# Altium schematic sheet Schematics1.SchDoc
size A4
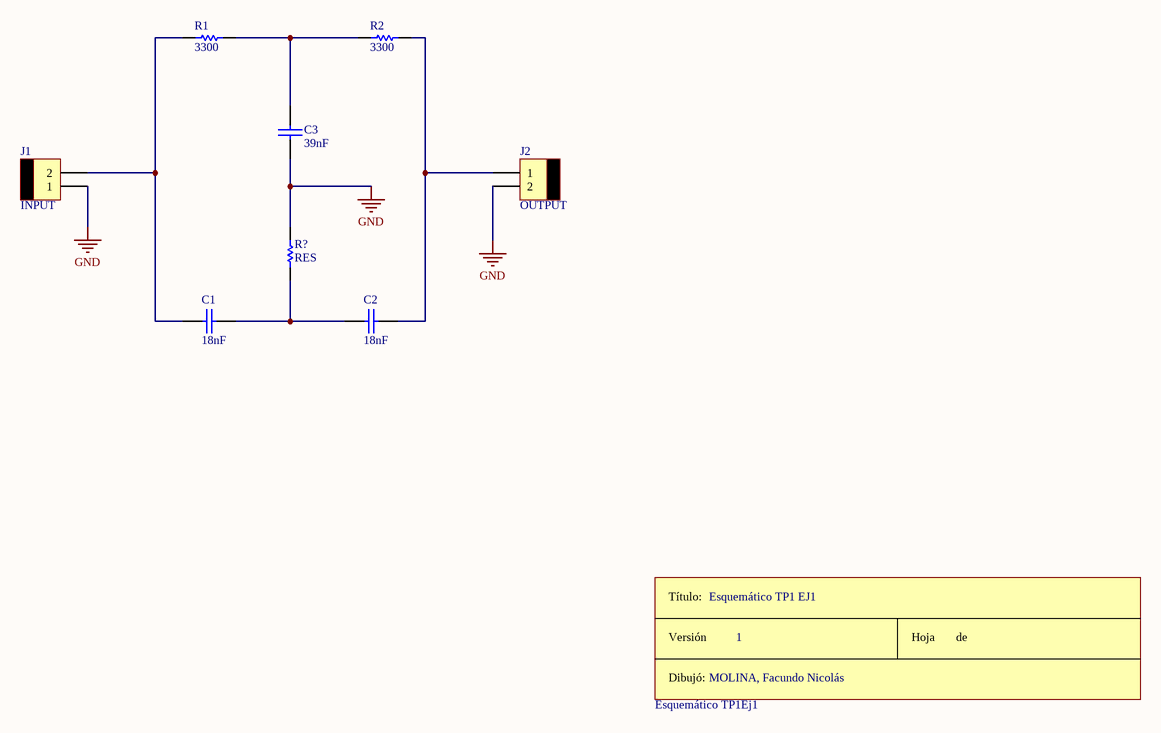
[diagram p0: Schematics1.SchDoc]

## Parts
C1  18nF  [CAP100]
C2  18nF  [CAP100]
C3  39nF  [CAP100]
Esquemático_TP1Ej1  (no value)
J1  INPUT  [MOLEX2]
J2  OUTPUT  [MOLEX2]
R1  3300  [RES300]
R2  3300  [RES300]
R?  RES  [RES300]

## Nets
GND: C3.2 J1.1 J2.2 R?.2
NetC1_1: C1.1 J1.2 R1.1
NetC1_2: C1.2 C2.1 R?.1
NetC2_2: C2.2 J2.1 R2.2
NetC3_1: C3.1 R1.2 R2.1

## Notes on the sheet
- Esquemático TP1 EJ1
- MOLINA, Facundo Nicolás
- 1
- (in symbol Rótulo) Título:; Versión; Hoja       de; Dibujó:

## Library data of the parts
C1-C3 = CAP
Esquemático_TP1Ej1 = Rótulo
J1 J2 = MOLEX2
R1 R2 = RES